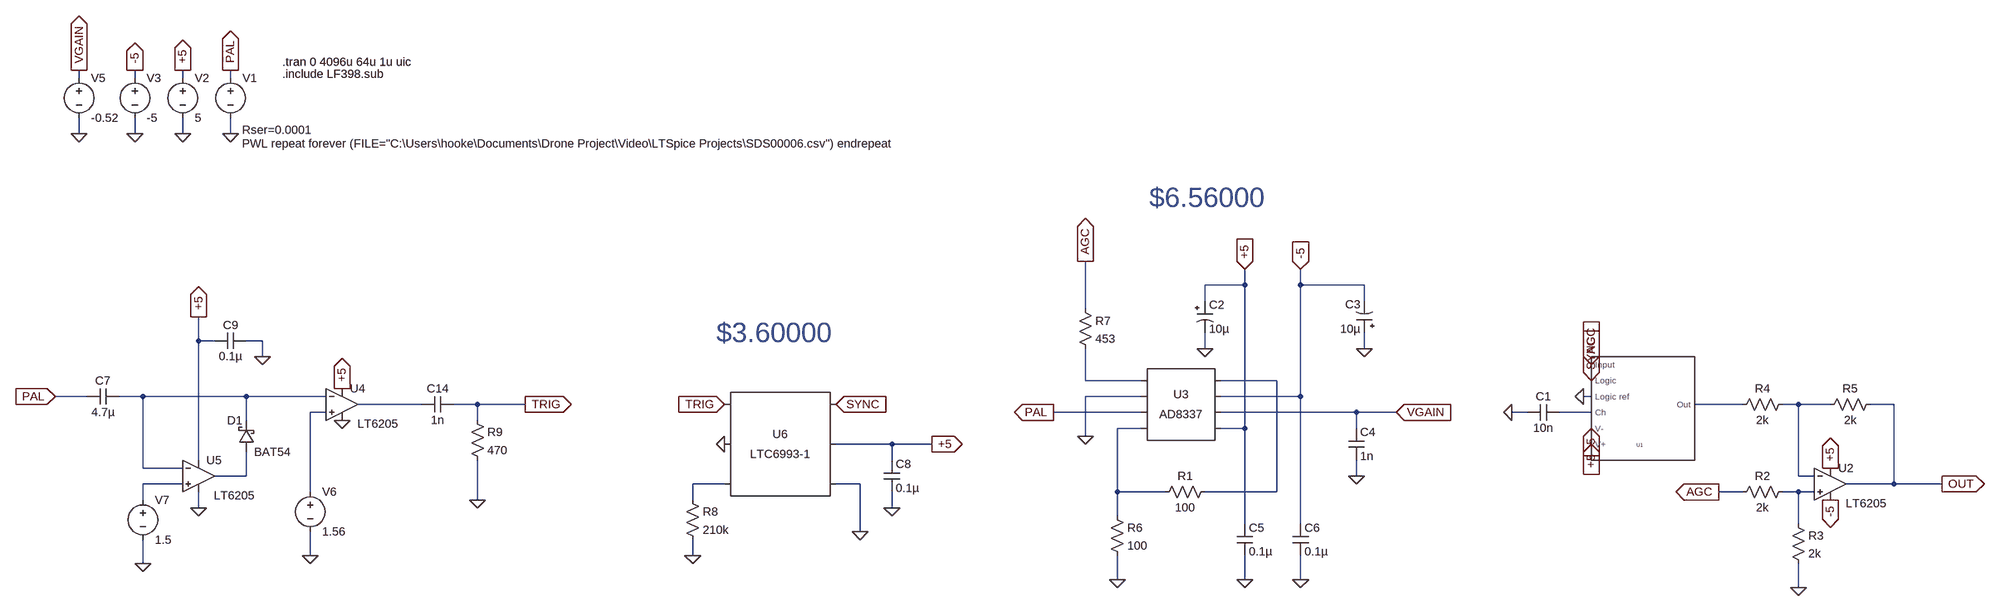
[diagram p0: schematic lf398.asc]
lf398.asc, the LTspice schematic file:
Version 4
SHEET 1 3268 2756
WIRE -1856 512 -1856 496
WIRE -1744 512 -1744 496
WIRE -1648 512 -1648 496
WIRE -1552 512 -1552 496
WIRE -1856 624 -1856 592
WIRE -1744 624 -1744 592
WIRE -1648 624 -1648 592
WIRE -1552 624 -1552 592
WIRE 608 928 608 896
WIRE 608 928 528 928
WIRE 720 928 720 896
WIRE 848 928 720 928
WIRE 528 960 528 928
WIRE 848 960 848 928
WIRE 288 976 288 880
WIRE -1616 1040 -1616 992
WIRE -1584 1040 -1616 1040
WIRE -1488 1040 -1520 1040
WIRE 528 1056 528 1024
WIRE 848 1056 848 1024
WIRE -1488 1072 -1488 1040
WIRE 288 1120 288 1056
WIRE 400 1120 288 1120
WIRE 672 1120 560 1120
WIRE -1840 1152 -1904 1152
WIRE -1728 1152 -1776 1152
WIRE -1520 1152 -1728 1152
WIRE -1360 1152 -1520 1152
WIRE 400 1152 288 1152
WIRE 720 1152 720 928
WIRE 720 1152 560 1152
WIRE 1312 1152 1296 1152
WIRE -1168 1168 -1296 1168
WIRE -1056 1168 -1104 1168
WIRE -960 1168 -1056 1168
WIRE 1616 1168 1520 1168
WIRE 1728 1168 1696 1168
WIRE 1792 1168 1728 1168
WIRE 1920 1168 1872 1168
WIRE -1360 1184 -1392 1184
WIRE 400 1184 224 1184
WIRE 832 1184 560 1184
WIRE 912 1184 832 1184
WIRE 1184 1184 1152 1184
WIRE 1312 1184 1248 1184
WIRE -1520 1200 -1520 1152
WIRE -1056 1200 -1056 1168
WIRE 400 1216 352 1216
WIRE 608 1216 608 928
WIRE 608 1216 560 1216
WIRE 832 1216 832 1184
WIRE 288 1232 288 1152
WIRE -224 1248 -336 1248
WIRE -144 1248 -224 1248
WIRE -1616 1280 -1616 1040
WIRE -224 1280 -224 1248
WIRE -1728 1296 -1728 1152
WIRE -1648 1296 -1728 1296
WIRE -1520 1312 -1520 1264
WIRE -1520 1312 -1584 1312
WIRE 832 1312 832 1280
WIRE 1728 1312 1728 1168
WIRE 1760 1312 1728 1312
WIRE -1648 1328 -1728 1328
WIRE -560 1328 -624 1328
WIRE -288 1328 -336 1328
WIRE 1920 1328 1920 1168
WIRE 1920 1328 1824 1328
WIRE 2016 1328 1920 1328
WIRE -1392 1344 -1392 1184
WIRE 352 1344 352 1216
WIRE 448 1344 352 1344
WIRE 672 1344 672 1120
WIRE 672 1344 528 1344
WIRE 1616 1344 1568 1344
WIRE 1728 1344 1696 1344
WIRE 1760 1344 1728 1344
WIRE -1728 1360 -1728 1328
WIRE -1056 1360 -1056 1280
WIRE -624 1360 -624 1328
WIRE -1616 1376 -1616 1344
WIRE -224 1376 -224 1344
WIRE 352 1392 352 1344
WIRE 608 1408 608 1216
WIRE 720 1408 720 1152
WIRE 1728 1408 1728 1344
WIRE -288 1424 -288 1328
WIRE -1392 1472 -1392 1424
WIRE -624 1472 -624 1440
WIRE -1728 1488 -1728 1440
WIRE 352 1520 352 1472
WIRE 608 1520 608 1472
WIRE 720 1520 720 1472
WIRE 1728 1536 1728 1488
FLAG 1296 1152 0
FLAG 1152 1184 0
FLAG -1552 496 PAL
IOPIN -1552 496 Out
FLAG -1552 624 0
FLAG -1648 496 +5
IOPIN -1648 496 Out
FLAG -1744 496 -5
IOPIN -1744 496 Out
FLAG -1648 624 0
FLAG -1744 624 0
FLAG 1312 1248 +5
IOPIN 1312 1248 In
FLAG 1312 1216 -5
IOPIN 1312 1216 In
FLAG 1792 1296 +5
IOPIN 1792 1296 Out
FLAG 1792 1360 -5
IOPIN 1792 1360 Out
FLAG 1728 1536 0
FLAG 288 1232 0
FLAG 528 1056 0
FLAG 848 1056 0
FLAG 832 1312 0
FLAG 912 1184 VGAIN
IOPIN 912 1184 In
FLAG -1856 624 0
FLAG -1856 496 VGAIN
IOPIN -1856 496 Out
FLAG 608 896 +5
IOPIN 608 896 In
FLAG 720 896 -5
IOPIN 720 896 In
FLAG 608 1520 0
FLAG 720 1520 0
FLAG 352 1520 0
FLAG 224 1184 PAL
IOPIN 224 1184 Out
FLAG 288 880 AGC
IOPIN 288 880 Out
FLAG 1312 1088 AGC
IOPIN 1312 1088 In
FLAG 1568 1344 AGC
IOPIN 1568 1344 Out
FLAG -1392 1472 0
FLAG -1328 1136 +5
IOPIN -1328 1136 Out
FLAG -1488 1072 0
FLAG -1616 1376 0
FLAG -1616 992 +5
IOPIN -1616 992 Out
FLAG -1328 1200 0
FLAG -1728 1488 0
FLAG -336 1168 SYNC
IOPIN -336 1168 In
FLAG -560 1248 0
FLAG -144 1248 +5
IOPIN -144 1248 Out
FLAG -624 1472 0
FLAG -224 1376 0
FLAG -288 1424 0
FLAG -1904 1152 PAL
IOPIN -1904 1152 In
FLAG -1056 1360 0
FLAG -560 1168 TRIG
IOPIN -560 1168 In
FLAG -960 1168 TRIG
IOPIN -960 1168 Out
FLAG 1312 1120 SYNC
IOPIN 1312 1120 In
FLAG 2016 1328 OUT
IOPIN 2016 1328 Out
SYMBOL LF398 1392 1136 R0
WINDOW 0 11 114 Left 0
SYMATTR InstName U1
SYMBOL voltage -1552 496 R0
WINDOW 39 23 120 Left 2
WINDOW 3 23 148 Left 2
SYMATTR SpiceLine Rser=0.0001
SYMATTR Value PWL repeat forever (FILE="C:\Users\hooke\Documents\Drone Project\Video\LTSpice Projects\SDS00006.csv") endrepeat
SYMATTR InstName V1
SYMBOL voltage -1648 496 R0
WINDOW 123 0 0 Left 0
WINDOW 39 0 0 Left 0
SYMATTR InstName V2
SYMATTR Value 5
SYMBOL voltage -1744 496 R0
WINDOW 123 0 0 Left 0
WINDOW 39 0 0 Left 0
SYMATTR InstName V3
SYMATTR Value -5
SYMBOL cap 1248 1168 R90
WINDOW 0 0 32 VBottom 2
WINDOW 3 32 32 VTop 2
SYMATTR InstName C1
SYMATTR Value 10n
SYMBOL res 1712 1328 R90
WINDOW 0 0 56 VBottom 2
WINDOW 3 32 56 VTop 2
SYMATTR InstName R2
SYMATTR Value 2k
SYMBOL res 1712 1392 R0
SYMATTR InstName R3
SYMATTR Value 2k
SYMBOL res 1712 1152 R90
WINDOW 0 0 56 VBottom 2
WINDOW 3 32 56 VTop 2
SYMATTR InstName R4
SYMATTR Value 2k
SYMBOL res 1888 1152 R90
WINDOW 0 0 56 VBottom 2
WINDOW 3 32 56 VTop 2
SYMATTR InstName R5
SYMATTR Value 2k
SYMBOL Opamps\\LT6205 1792 1328 R0
WINDOW 3 31 39 Left 2
SYMATTR InstName U2
SYMBOL res 544 1328 R90
WINDOW 0 0 56 VBottom 2
WINDOW 3 32 56 VTop 2
SYMATTR InstName R1
SYMATTR Value 100
SYMBOL res 336 1376 R0
SYMATTR InstName R6
SYMATTR Value 100
SYMBOL polcap 512 960 R0
SYMATTR InstName C2
SYMATTR Value 10µ
SYMBOL polcap 864 1024 R180
WINDOW 0 24 57 Left 2
WINDOW 3 24 8 Left 2
SYMATTR InstName C3
SYMATTR Value 10µ
SYMBOL res 272 960 R0
SYMATTR InstName R7
SYMATTR Value 453
SYMBOL cap 816 1216 R0
SYMATTR InstName C4
SYMATTR Value 1n
SYMBOL voltage -1856 496 R0
WINDOW 123 0 0 Left 0
WINDOW 39 0 0 Left 0
SYMATTR InstName V5
SYMATTR Value -0.52
SYMBOL cap 592 1408 R0
SYMATTR InstName C5
SYMATTR Value 0.1µ
SYMBOL cap 704 1408 R0
SYMATTR InstName C6
SYMATTR Value 0.1µ
SYMBOL cap -1776 1136 R90
WINDOW 0 0 32 VBottom 2
WINDOW 3 32 32 VTop 2
SYMATTR InstName C7
SYMATTR Value 4.7µ
SYMBOL voltage -1392 1328 R0
WINDOW 123 0 0 Left 0
WINDOW 39 0 0 Left 0
SYMATTR InstName V6
SYMATTR Value 1.56
SYMBOL cap -1520 1024 R90
WINDOW 0 0 32 VBottom 2
WINDOW 3 32 32 VTop 2
SYMATTR InstName C9
SYMATTR Value 0.1µ
SYMBOL schottky -1504 1264 R180
WINDOW 0 24 64 Left 2
WINDOW 3 -73 0 Left 2
SYMATTR InstName D1
SYMATTR Value BAT54
SYMATTR Description Diode
SYMATTR Type diode
SYMBOL voltage -1728 1344 R0
WINDOW 123 0 0 Left 0
WINDOW 39 0 0 Left 0
SYMATTR InstName V7
SYMATTR Value 1.5
SYMBOL res -640 1344 R0
SYMATTR InstName R8
SYMATTR Value 210k
SYMBOL cap -240 1280 R0
SYMATTR InstName C8
SYMATTR Value 0.1µ
SYMBOL SpecialFunctions\\LTC6993-1 -448 1248 R0
SYMATTR InstName U6
SYMBOL AutoGenerated\\AD8337 480 1168 R0
SYMATTR InstName U3
SYMBOL cap -1104 1152 R90
WINDOW 0 0 32 VBottom 2
WINDOW 3 32 32 VTop 2
SYMATTR InstName C14
SYMATTR Value 1n
SYMBOL res -1072 1184 R0
SYMATTR InstName R9
SYMATTR Value 470
SYMBOL Opamps\\LT6205 -1616 1312 R0
WINDOW 3 31 39 Left 2
SYMATTR InstName U5
SYMBOL Opamps\\LT6205 -1328 1168 R0
WINDOW 3 31 39 Left 2
SYMATTR InstName U4
TEXT -1448 480 Left 2 !.tran 0 4096u 64u 1u uic
TEXT -1448 504 Left 2 !.include LF398.sub
TEXT 416 752 Left 5 ;$6.56000
TEXT -576 1024 Left 5 ;$3.60000

The netlist it stands for:
* lf398.asc
XU1 AGC SYNC 0 -5 N008 N005 +5 LF398H  ; pins Input Logic Logic_ref V- Ch Out V+
V1 PAL 0 PWL repeat forever (FILE="C:\Users\hooke\Documents\Drone Project\Video\LTSpice Projects\SDS00006.csv") endrepeat Rser=0.0001
V2 +5 0 5
V3 -5 0 -5
C1 N008 0 10n
R2 N013 AGC 2k
R3 N013 0 2k
R4 N006 N005 2k
R5 OUT N006 2k
* U2: LT6205 (symbol Opamps\LT6205 not available, pins judged from their places): In+=N013 In-=N006 V+=+5 V-=-5 OUT=OUT
R1 N002 N009 100
R6 N009 0 100
C2 +5 0 10µ
C3 0 -5 10µ
R7 AGC N001 453
C4 VGAIN 0 1n
V5 VGAIN 0 -0.52
C5 +5 0 0.1µ
C6 -5 0 0.1µ
C7 N003 PAL 4.7µ
V6 N007 0 1.56
C9 0 +5 0.1µ
D1 N010 N003 BAT54
V7 N011 0 1.5
R8 N012 0 210k
C8 +5 0 0.1µ
XU6 TRIG 0 N012 0 +5 SYNC LTC6993-1
* U3: AD8337 (symbol AutoGenerated\AD8337 not available, pins judged from their places): pin1=N001 pin2=0 pin3=PAL pin4=N009 pin5=N002 pin6=-5 pin7=VGAIN pin8=+5
C14 TRIG N004 1n
R9 TRIG 0 470
* U5: LT6205 (symbol Opamps\LT6205 not available, pins judged from their places): In+=N011 In-=N003 V+=+5 V-=0 OUT=N010
* U4: LT6205 (symbol Opamps\LT6205 not available, pins judged from their places): In+=N007 In-=N003 V+=+5 V-=0 OUT=N004
.model D D
.lib standard.dio
.tran 0 4096u 64u 1u uic
.include LF398.sub
* $6.56000
* $3.60000
.backanno
.end